# Altium schematic sheet Top.SchDoc
size Letter; DocumentNumber: 1; SheetNumber: 1; SheetTotal: 7
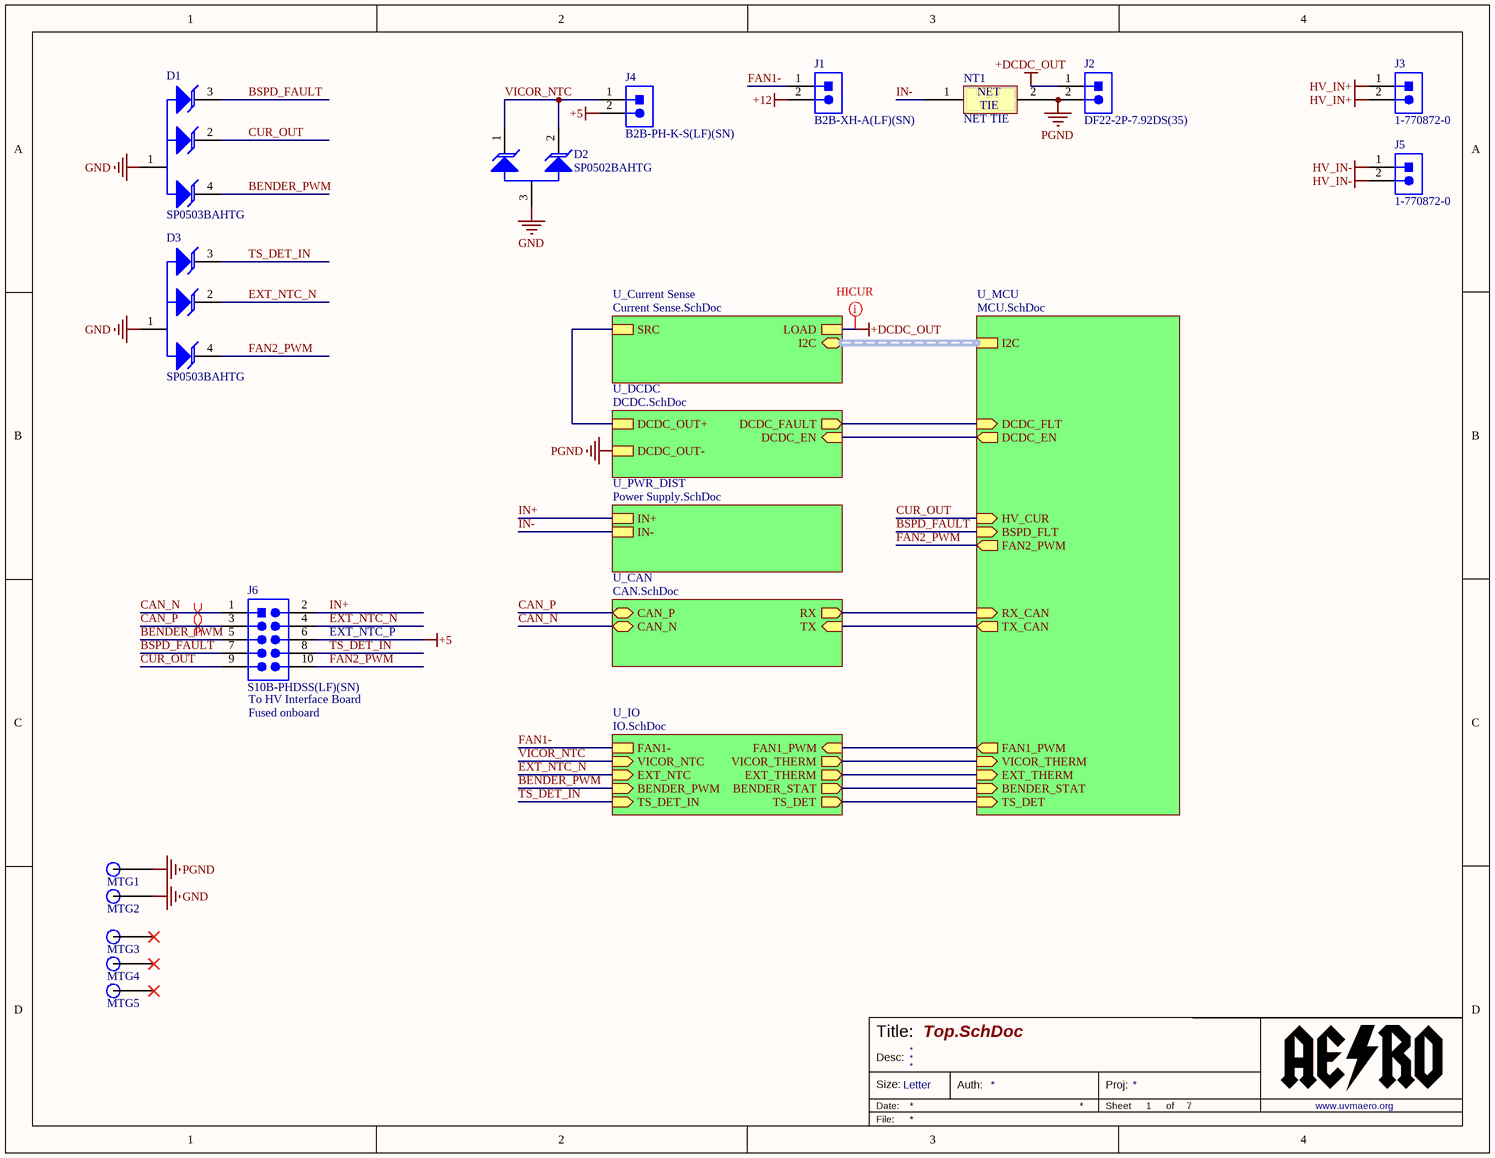
[diagram p0: Top.SchDoc]

## Parts
D1  SP0503BAHTG  [Littelfuse_SP0503BAHTG_0]
D2  SP0502BAHTG  [TO-236 SOT23]
D3  SP0503BAHTG  [Littelfuse_SP0503BAHTG_0]
J1  B2B-XH-A(LF)(SN)  [B2B-XH-A(LF)(SN)]
J2  DF22-2P-7.92DS(35)  [CON2-1X2_RZ_DF22]
J3  1-770872-0  [CON2_1X2_P163_VM]
J4  B2B-PH-K-S(LF)(SN)  [JST_Sales_America_Inc._B2B-PH-K-S_LF_SN_0]
J5  1-770872-0  [CON2_1X2_P163_VM]
J6  S10B-PHDSS(LF)(SN)  [S10B-PHDSS]
MTG1  PCB MTG M3  [MTG-M3]  (value not drawn)  (no BOM)
MTG2  PCB MTG M3  [MTG-M3]  (value not drawn)  (no BOM)
MTG3  PCB MTG M3 HV  [MTG-M3-HV]  (value not drawn)  (no BOM)
MTG4  PCB MTG M3 HV  [MTG-M3-HV]  (value not drawn)  (no BOM)
MTG5  PCB MTG M3 HV  [MTG-M3-HV]  (value not drawn)  (no BOM)
NT1  NET TIE  [60MIL_TIE]  (net tie, no BOM)

## Sub-sheets
U_CAN = CAN.SchDoc: CAN_P (bidir), CAN_N (bidir), RX (out), TX (in)
U_Current Sense = Current Sense.SchDoc: I2C (bidir, harness I2C), SRC, LOAD
U_DCDC = DCDC.SchDoc: DCDC_FAULT (out), DCDC_EN (in), DCDC_OUT+, DCDC_OUT-
U_IO = IO.SchDoc: VICOR_THERM (out), EXT_THERM (out), FAN1-, FAN1_PWM (in), BENDER_PWM (in), BENDER_STAT (out), VICOR_NTC (in), EXT_NTC (in), TS_DET (out), TS_DET_IN (in)
U_MCU = MCU.SchDoc: I2C (harness I2C), HV_CUR (in), VICOR_THERM (in), DCDC_EN (out), EXT_THERM (in), FAN2_PWM (out), FAN1_PWM (out), RX_CAN (in), TX_CAN (out), DCDC_FLT (in), BSPD_FLT (in), BENDER_STAT (in), TS_DET (in)
U_PWR_DIST = Power Supply.SchDoc: IN+, IN-

## Nets
+5: J4.2 J6.6
+12: J1.2
+DCDC_OUT: J2.1 ; sheet U_Current Sense/LOAD
GND: D1.1 D2.3 D3.1 MTG2.1
HV_IN+: J3.1 J3.2
HV_IN-: J5.1 J5.2
PGND: J2.2 MTG1.1 NT1.2 ; sheet U_DCDC/DCDC_OUT-
BENDER_PWM: D1.4 J6.5 ; sheet U_IO/BENDER_PWM
BSPD_FAULT: D1.3 J6.7 ; sheet U_MCU/BSPD_FLT
CAN_N: J6.1 ; sheet U_CAN/CAN_N
CAN_P: J6.3 ; sheet U_CAN/CAN_P
CUR_OUT: D1.2 J6.9 ; sheet U_MCU/HV_CUR
EXT_NTC_N: D3.2 J6.4 ; sheet U_IO/EXT_NTC
FAN1-: J1.1 ; sheet U_IO/FAN1-
FAN2_PWM: D3.4 J6.10 ; sheet U_MCU/FAN2_PWM
IN+: J6.2 ; sheet U_PWR_DIST/IN+
IN-: NT1.1 ; sheet U_PWR_DIST/IN-
TS_DET_IN: D3.3 J6.8 ; sheet U_IO/TS_DET_IN
VICOR_NTC: D2.1 D2.2 J4.1 ; sheet U_IO/VICOR_NTC
(unnamed): sheet U_DCDC/DCDC_FAULT, sheet U_MCU/DCDC_FLT
(unnamed): sheet U_DCDC/DCDC_EN, sheet U_MCU/DCDC_EN
(unnamed): sheet U_DCDC/DCDC_OUT+, sheet U_Current Sense/SRC
(unnamed): sheet U_CAN/RX, sheet U_MCU/RX_CAN
(unnamed): sheet U_CAN/TX, sheet U_MCU/TX_CAN
(unnamed): sheet U_MCU/VICOR_THERM, sheet U_IO/VICOR_THERM
(unnamed): sheet U_MCU/EXT_THERM, sheet U_IO/EXT_THERM
(unnamed): sheet U_MCU/FAN1_PWM, sheet U_IO/FAN1_PWM
(unnamed): sheet U_MCU/BENDER_STAT, sheet U_IO/BENDER_STAT
(unnamed): sheet U_MCU/TS_DET, sheet U_IO/TS_DET

Not connected (* = marked no-connect by the designer): MTG3 1*; MTG4 1*; MTG5 1*

## Buses and harness runs
harness sheet U_Current Sense/I2C = sheet U_MCU/I2C

## Layout directives
differential pair; differential pair class CAN: CAN_N, CAN_P
net class HICUR: +DCDC_OUT

## Notes on the sheet
- (near J6) EXT_NTC_P
- (near J6) To HV Interface Board
- (near J6) Fused onboard
- Title:
- Size:
- Date:
- Desc:
- Letter
- Auth:
- Sheet
- Proj:
- *
- of
- www.uvmaero.org
- File:
- (in symbol NET TIE) NET; TIE

## Library data of the parts
D1 D3 = SP0503BAHTG: 8.5V Clamp  Ipp Tvs Diode Surface Mount SOT-23-5 5.5V; Manufacturer: Littelfuse; Capacitance: 30pF; Diode Type: Avalanche; Direction: Unidirectional; Element Configuration: Common Anode; ESD Protection: Yes; Leakage Current: 100nA; Max Power Dissipation: 225mW; Number of Channels: 3; Polarity: Bidirectional,Unidirectional; Power Line Protection: No; Voltage Rating (DC): 5V; Breakdown Voltage: 5.5V; Case/Package: SOT-143; Category: Diodes; Clamping Voltage: 8.5V; Composition: Zener; Depth: 1.4mm; Height: 1.05mm; Lead Free: Lead Free; Length: 3.04mm; Manufacturer Part Number: SP0503BAHTG; Max Operating Temperature: 85°C; Max Reverse Leakage Current: 100nA; Min Operating Temperature: -40°C; Mount: Surface Mount; Number of Elements: 3; Number of Pins: 4; Number of Unidirectional Channels: 3; Operating Supply Voltage: 5.5V; Packaging: Tape and Reel; Peak Pulse Power: 225mW; Power Dissipation: 225mW; Radiation Hardening: No; REACH SVHC: No SVHC; Reverse Standoff Voltage: 5.5V; Termination: SMD/SMT; Width: 1.4mm; Working Voltage: 5.5V; Supplier 1: Digi-Key; Supplier Part Number 1: F3157DKR-ND
D2 = SP0502BAHTG: 8.5V Clamp  Ipp Tvs Diode Surface Mount SOT-23-5 5.5V; Manufacturer: Littelfuse; Capacitance: 30pF; Diode Type: Avalanche; Direction: Unidirectional; Element Configuration: Common Anode; ESD Protection: Yes; Leakage Current: 100nA; Max Power Dissipation: 225mW; Number of Channels: 2; Operating Supply Voltage: 5V; Polarity: Bidirectional,Unidirectional; Power Line Protection: No; Working Voltage: 5.5V; Breakdown Voltage: 5.5V; Case/Package: SOT-23-3; Category: Diodes; Clamping Voltage: 8.5V; Composition: Zener; Depth: 1.35mm; Height: 1.12mm; Lead Free: Lead Free; Length: 3.04mm; Manufacturer Part Number: SP0502BAHTG; Max Operating Temperature: 85°C; Max Reverse Leakage Current: 100nA; Min Operating Temperature: -40°C; Mount: Surface Mount; Number of Elements: 2; Number of Pins: 3; Number of Unidirectional Channels: 2; Packaging: Tape and Reel; Peak Pulse Power: 225mW; Power Dissipation: 225mW; Radiation Hardening: No; REACH SVHC: No SVHC; Reverse Standoff Voltage: 5.5V; Termination: SMD/SMT; Voltage Rating (DC): 5V; Width: 1.4mm; Supplier 1: Digi-Key; Supplier Part Number 1: F2714CT-ND
J1 = B2B-XH-A(LF)(SN): CONN HEADER VERT 2POS 2.5MM; Manufacturer: JST; Connector Type: Male Pin; Contact Resistance: 20mR; Current Rating: 3A; Insulation Resistance: 1GR; Max Voltage Rating (AC): 250V; Number of Contacts: 2; Wire/Cable Gauge: 22AWG; Category: FFC / FPC; Color: Natural; Contact Material: Brass; Contact Plating: Tin,Copper,Lead; Depth: 5.75mm; Fastening Type: Detent; Housing Color: White; Housing Material: Polyamide; Lead Free: Lead Free; Lead Pitch: 2.5mm; Length: 7.4mm; Manufacturer Part Number: B2B-XH-A(LF)(SN); Max Current Rating: 3A; Max Operating Temperature: 85°C; Max Voltage Rating (DC): 250V; Min Operating Temperature: -25°C; Mount: Through Hole; Number of Positions: 2; Number of Rows: 1; Orientation: Straight; Packaging: Bulk; Pitch: 2.5mm; REACH SVHC: No SVHC; Termination: Solder; Voltage Rating: 250V; Voltage Rating (AC): 250V; Supplier 1: Newark; Supplier Part Number 1: 73M9415
J2 = DF22-2P-7.92DS(35): Connector Header Through Hole, Right Angle 2 position 0.312" (7.92mm); Manufacturer: Hirose; Connector Type: Male Pin; Number of Positions: 2; Pitch: 0.312inch; Category: Connectors; Contact Mating Length: 0.354inch; Contact Plating: Tin; Fastening Type: Latch; Manufacturer Part Number: DF22-2P-7.92DS(35); Mount: Through Hole; Number of Pins: 2; Number of Rows: 1; Packaging: Bulk; Termination: Solder; Supplier 1: Digi-Key; Supplier Part Number 1: H125155-ND
J3 J5 = 1-770872-0: Connector Header Through Hole 2 position 0.163" (4.14mm); Vendor: TE Connectivity; Built_By: EMA_UL_Team; Approvals: CSA; Circuit Application: Power; Connector System: Wire-to-Board; Connector Type: Pin; Contact Current Rating: 9.5A; Contact Retention: No (Without); Gender: Male; Mating Alignment: Yes (With); Max Voltage Rating (AC): 600V; Number of Circuits: 2; Number of Ports: 1; PCB Mount Retention: With; PCB Mounting Orientation: Vertical; PCB Thickness: 0.062mm; Pitch: 0.162inch; Plating Thickness: 150um; VDE Tested: Yes; Manufacturer_Part_Number: 1-770872-0; Copyright: Copyright (C) 2018 Accelerated Designs. All rights reserved; RefDes: RefDes; Type: DEV; Value: Value; Supplier 1: Digi-Key; Supplier Part Number 1: A32449-ND; Category: Connectors; Color: White; Contact Gender: Male; Contact Material: Brass; Contact Plating: Tin; Current Rating: 9.5A; Depth: 6.35mm; ELV: Compliant; Fastening Type: Ramp; Flammability Rating: UL94 V-0; Height: 13.49mm; Housing Color: White; Housing Material: Nylon; Lead Free: Lead Free; Length: 9.83mm; Manufacturer: TE Connectivity; Manufacturer Part Number: 1-770872-0; Mating Retention: Yes (With); Max Operating Temperature: 221°C; Min Operating Temperature: -67°C; Mount: Through Hole; Number of Contacts: 2; Number of Positions: 2; Number of Power Positions: 2; Number of Rows: 1; Number of Terminals: 2; Orientation: Straight; Package Quantity: 200; Packaging: Bag; PCB Mount Alignment: No (Without); Radiation Hardening: No; REACH SVHC: Unknown; Sealable: No (Without); Strain Relief: No (Without); Termination: Solder; Voltage Rating: 600V; Width: 9.83mm
J4 = B2B-PH-K-S(LF)(SN): Connector Header Through Hole 2 position 0.079" (2.00mm); Manufacturer: JST; Manufacturer Part Number: B2BPHKSLFSN; Connector Type: Male Pin; Contact Resistance: 20mR; Current Rating: 2A; Gender: Male; Insulation Resistance: 1MR; Max Voltage Rating (AC): 100V; Number of Contacts: 2; Pitch: 2mm; Category: Connectors; Color: Natural; Contact Material: Brass,Tin; Contact Mating Length: 0.13inch; Contact Plating: Tin,Copper; Depth: 4.5mm; Fastening Type: Detent; Height: 9.4mm; Housing Color: White; Housing Material: Polyamide; Lead Free: Lead Free; Lead Pitch: 2mm; Length: 5.9mm; Max Current Rating: 2A; Max Operating Temperature: 85°C; Max Voltage Rating (DC): 100V; Min Operating Temperature: -25°C; Mount: Through Hole; Number of Pins: 2; Number of Poles: 2; Number of Positions: 2; Number of Rows: 1; Orientation: Straight; Packaging: Bulk; REACH SVHC: No SVHC; Termination: Solder; Voltage Rating: 100V; Voltage Rating (AC): 100V; Width: 4.5mm; Working Voltage: 100V; Supplier 1: Newark; Supplier 2: Digi-Key; Supplier Part Number 1: 37K9940; Supplier Part Number 2: 455-1704-ND
J6 = S10B-PHDSS(LF)(SN): Connector Header Through Hole, Right Angle 10 position 0.079" (2.00mm); Manufacturer: JST; Connector Type: Male Pin; Contact Resistance: 20mR; Current Rating: 3A; Gender: Male; Max Voltage Rating (AC): 250V; Number of Contacts: 10; Pitch: 2mm; Row Spacing: 0.079inch; Category: Headers and Wire Housings; Color: Natural; Contact Material: Copper Alloy,Tin; Contact Mating Length: 0.114inch; Contact Plating: Tin,Copper; Depth: 9.5mm; Fastening Type: Detent; Height: 9.5mm; Housing Color: Beige; Housing Material: Polyamide; Lead Free: Lead Free; Length: 11.9mm; Manufacturer Part Number: S10B-PHDSS(LF)(SN); Max Current Rating: 3A; Max Operating Temperature: 85°C; Min Operating Temperature: -25°C; Mount: Through Hole; Number of Positions: 10; Number of Rows: 2; Orientation: Right Angle; Packaging: Bulk; Termination: Solder; Width: 5mm; Supplier 1: Digi-Key; Supplier Part Number 1: 455-1775-ND
MTG1 MTG2 = MTG M3: PCB Mounting for M3 Screw; P/N: MTG M3; PCB Package: M3
MTG3-MTG5 = MTG M3 HV: PCB Mounting for M3 Screw - HV; P/N: MTG M3 HV; PCB Package: M3
NT1 = NET TIE: Net Tie (No BOM); ClassName: NET_TIE